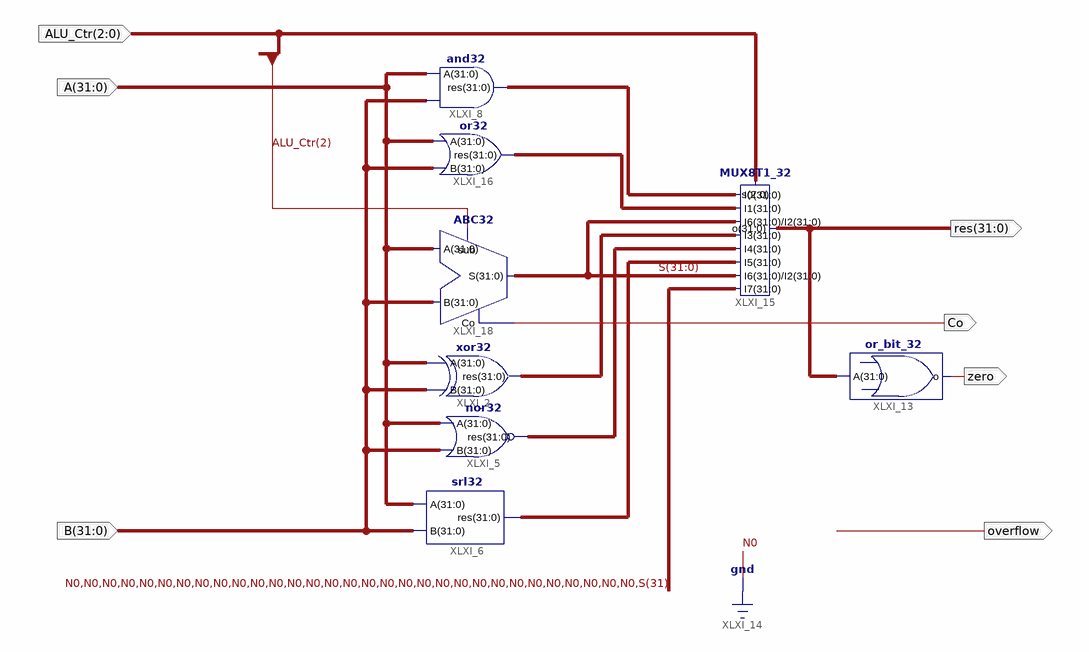
[diagram p0: schematic sheet 1]
// Xilinx ISE schematic ALU.sch (kintex7) as structural Verilog: 8 symbols, 7 ports
module ALU (
  input  [31:0] A,
  input  [31:0] B,
  input  [2:0] ALU_Ctr,
  output [31:0] res,
  output zero,
  output overflow,
  output Co
);

  wire [31:0] S, XLXN_20, XLXN_21, XLXN_22, XLXN_23, XLXN_24;

  xor32 XLXI_2 (.A(A), .B(B), .res(XLXN_20));
  nor32 XLXI_5 (.res(XLXN_21), .A(A), .B(B));
  srl32 XLXI_6 (.A(A), .B(B), .res(XLXN_22));
  and32 XLXI_8 (.res(XLXN_24), .A(A), .B(B));
  or_bit_32 XLXI_13 (.o(zero), .A(res));
  MUX8T1_32 XLXI_15 (
    .s(ALU_Ctr), .I7({{31{1'b0}}, S[31]}), .I6(S), .I5(XLXN_22), .I4(XLXN_21), .I3(XLXN_20), .I2(S),
    .I1(XLXN_23), .I0(XLXN_24), .o(res));
  or32 XLXI_16 (.A(A), .B(B), .res(XLXN_23));
  ABC32 XLXI_18 (.B(B), .A(A), .sub(ALU_Ctr[2]), .S(S), .Co(Co));
endmodule
